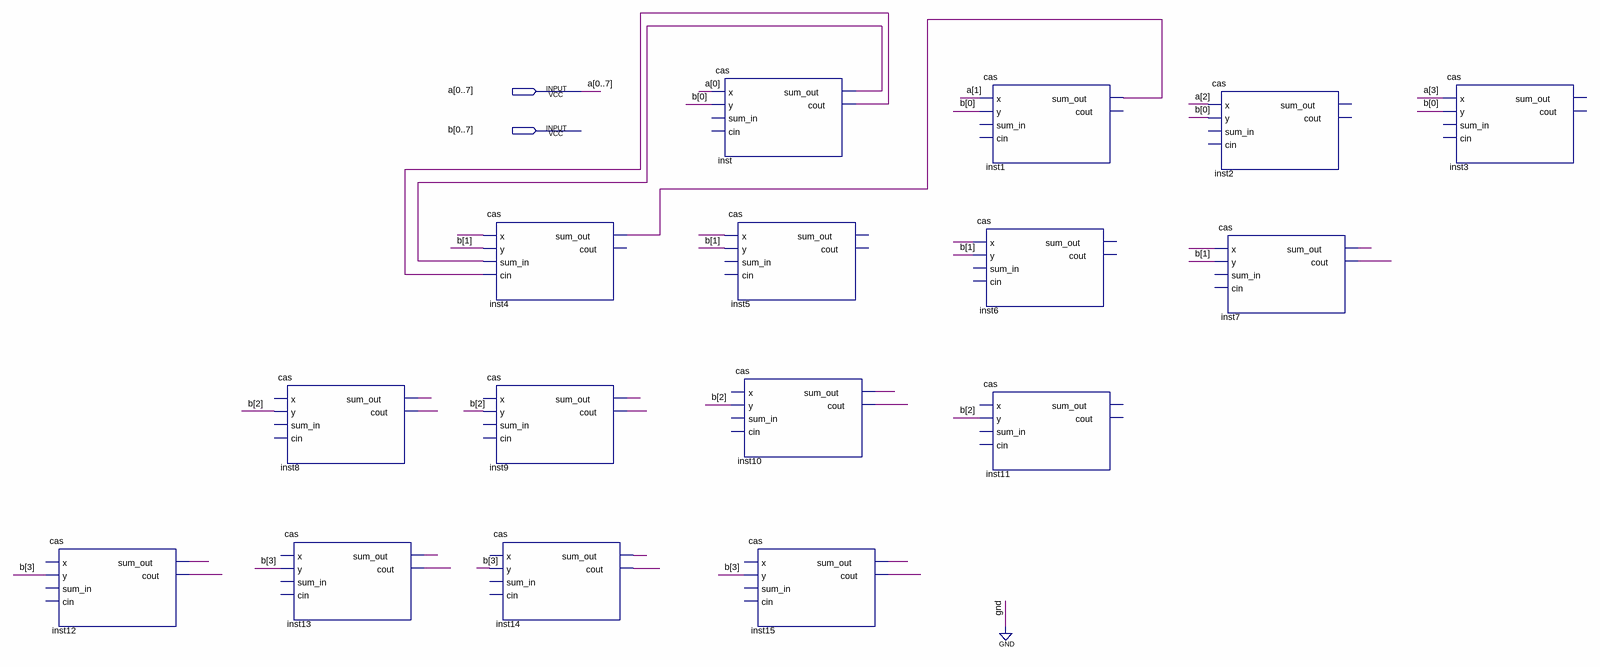
[diagram p0: schematic sheet]
// Quartus schematic 8x8multiplier2.bdf as structural Verilog: 16 symbols, 2 pins
module \8x8multiplier2  (
  input  [0:7] a,
  input  [0:7] b
);

  wire inst4_sum_out, inst7_cout, inst7_sum_out, inst8_cout, inst8_sum_out, inst9_cout, inst9_sum_out,
       inst10_cout, inst10_sum_out, inst12_cout, inst12_sum_out, inst13_cout, inst13_sum_out, inst14_cout,
       inst14_sum_out, inst15_cout, inst15_sum_out, inst_cout, inst_sum_out, undriven, undriven_2,
       undriven_3, undriven_4;

  cas inst12 (.y(b[3]), .sum_out(inst12_sum_out), .cout(inst12_cout));  // open: x, sum_in, cin
  cas inst8 (.y(b[2]), .sum_out(inst8_sum_out), .cout(inst8_cout));  // open: x, sum_in, cin
  cas inst13 (.y(b[3]), .sum_out(inst13_sum_out), .cout(inst13_cout));  // open: x, sum_in, cin
  cas inst4 (.x(undriven), .y(b[1]), .sum_in(inst_sum_out), .cin(inst_cout), .sum_out(inst4_sum_out));  // open: cout
  cas inst9 (.y(b[2]), .sum_out(inst9_sum_out), .cout(inst9_cout));  // open: x, sum_in, cin
  cas inst14 (.y(b[3]), .sum_out(inst14_sum_out), .cout(inst14_cout));  // open: x, sum_in, cin
  cas inst (.x(a[0]), .y(b[0]), .sum_out(inst_sum_out), .cout(inst_cout));  // open: sum_in, cin
  cas inst5 (.x(undriven_4), .y(b[1]));  // open: sum_in, cin, sum_out, cout
  cas inst10 (.y(b[2]), .sum_out(inst10_sum_out), .cout(inst10_cout));  // open: x, sum_in, cin
  cas inst15 (.y(b[3]), .sum_out(inst15_sum_out), .cout(inst15_cout));  // open: x, sum_in, cin
  cas inst1 (.x(a[1]), .y(b[0]), .sum_out(inst4_sum_out));  // open: sum_in, cin, cout
  cas inst6 (.x(undriven_3), .y(b[1]));  // open: sum_in, cin, sum_out, cout
  cas inst11 (.y(b[2]));  // open: x, sum_in, cin, sum_out, cout
  cas inst2 (.x(a[2]), .y(b[0]));  // open: sum_in, cin, sum_out, cout
  cas inst7 (.x(undriven_2), .y(b[1]), .sum_out(inst7_sum_out), .cout(inst7_cout));  // open: sum_in, cin
  cas inst3 (.x(a[3]), .y(b[0]));  // open: sum_in, cin, sum_out, cout
endmodule
